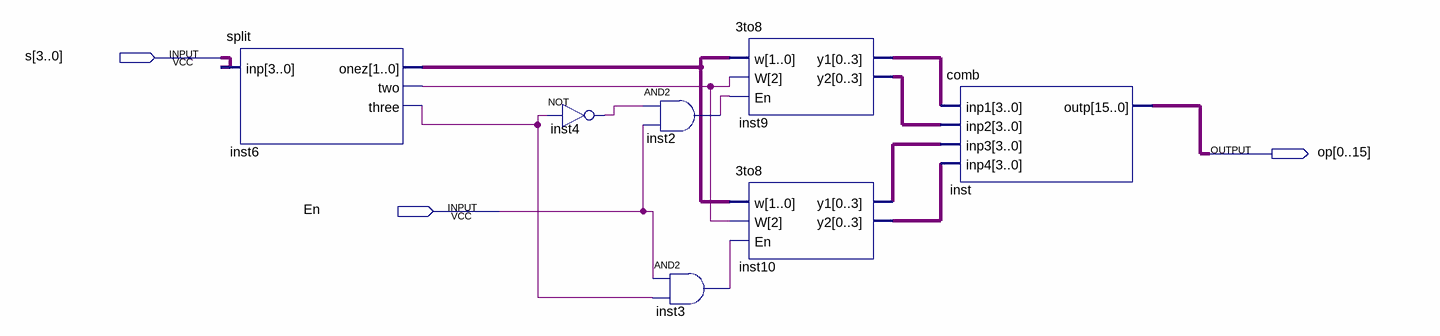
[diagram p0: schematic sheet]
// Quartus schematic 4to16.bdf as structural Verilog: 7 symbols, 3 pins
module \4to16  (
  input  [3:0] s,
  input  En,
  output [0:15] op
);

  wire inst2_out, inst3_out, inst4_out, inst6_three, inst6_two;
  wire [1:0] inst6_onez;
  wire [3:0] inst9_y1, inst9_y2, inst10_y1, inst10_y2;

  split inst6 (.inp(s), .onez(inst6_onez), .two(inst6_two), .three(inst6_three));
  not inst4 (inst4_out, inst6_three);
  and inst2 (inst2_out, inst4_out, En);
  and inst3 (inst3_out, En, inst6_three);
  \3to8  inst9 (.w(inst6_onez), .W(inst6_two), .En(inst2_out), .y1(inst9_y1), .y2(inst9_y2));
  \3to8  inst10 (.w(inst6_onez), .W(inst6_two), .En(inst3_out), .y1(inst10_y1), .y2(inst10_y2));
  comb inst (.inp1(inst9_y1), .inp2(inst9_y2), .inp3(inst10_y1), .inp4(inst10_y2), .outp(op));
endmodule
